# Altium schematic sheet 00_Index.SchDoc
size A4; SheetNumber: 1; SheetTotal: 5
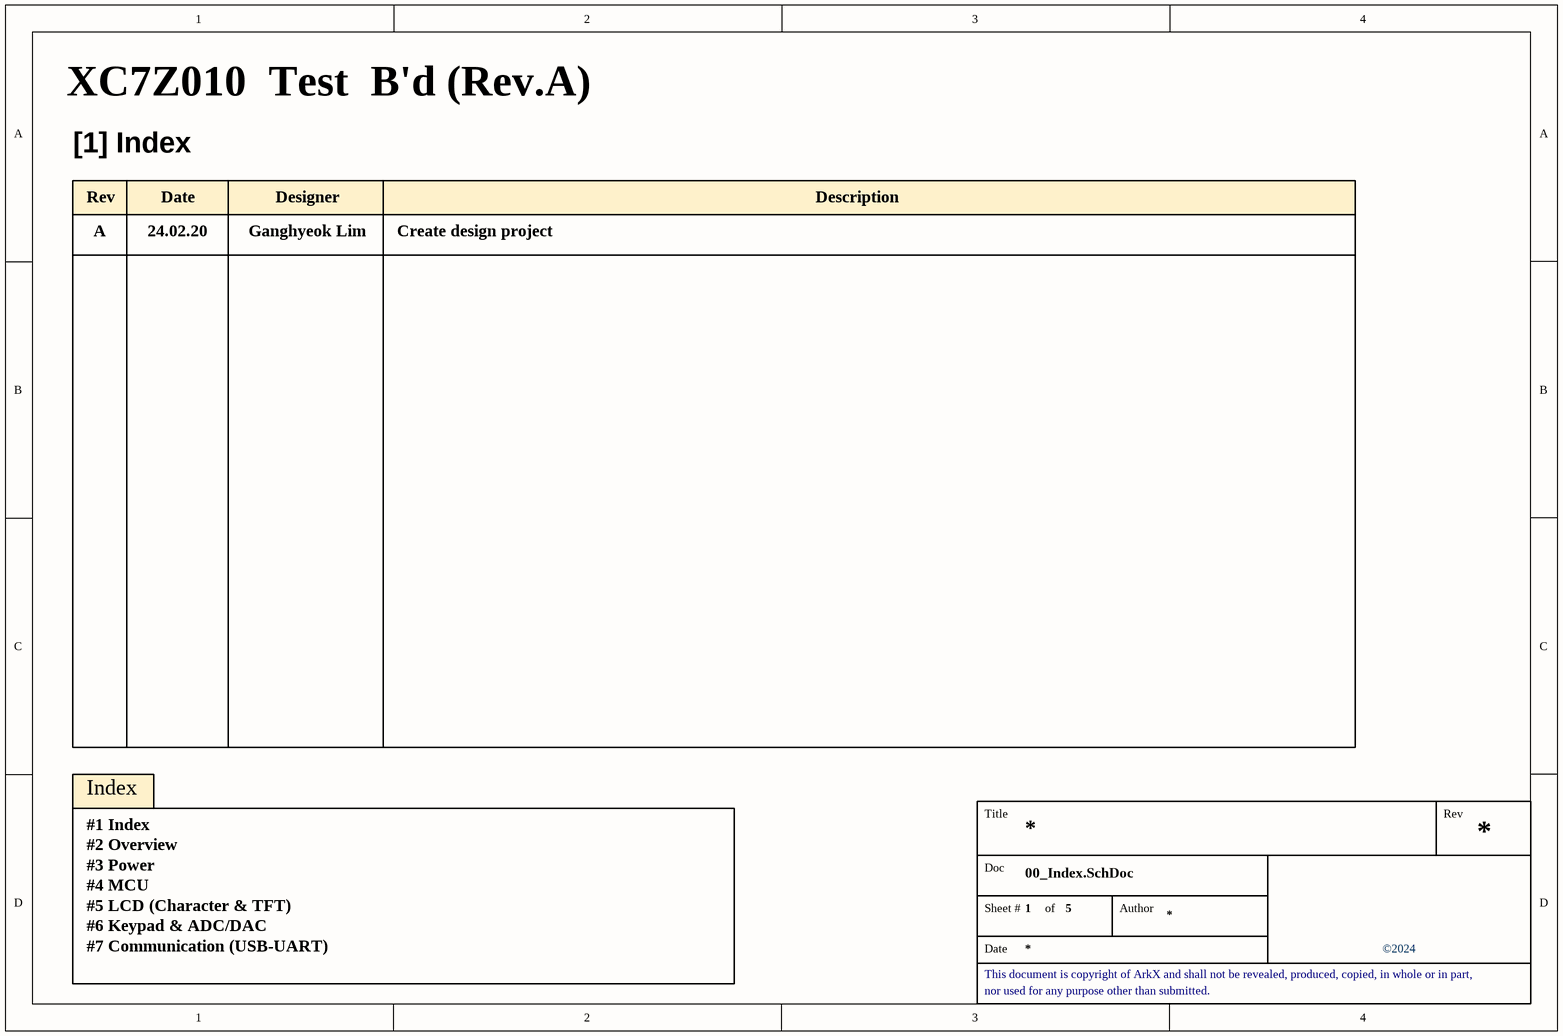
[diagram p0: 00_Index.SchDoc]

## Notes on the sheet
- XC7Z010  Test  B'd (Rev.A)
- [1] Index
- Rev
- A
- 24.02.20
- Date
- Ganghyeok Lim
- Designer
- Create design project
- Description
- Index
- #1 Index
- #2 Overview
- #3 Power
- #4 MCU
- #5 LCD (Character & TFT)
- #6 Keypad & ADC/DAC
- #7 Communication (USB-UART)
- Title
- Doc
- Sheet #
- of
- Author
- This document is copyright of ArkX and shall not be revealed, produced, copied, in whole or in part,
- ©2024
- nor used for any purpose other than submitted.